# EAGLE design BOTTOM_BRD_v.1.0.4 (EAGLE 9.6.2)
NYU Shanghai Swarm Robotics 2020
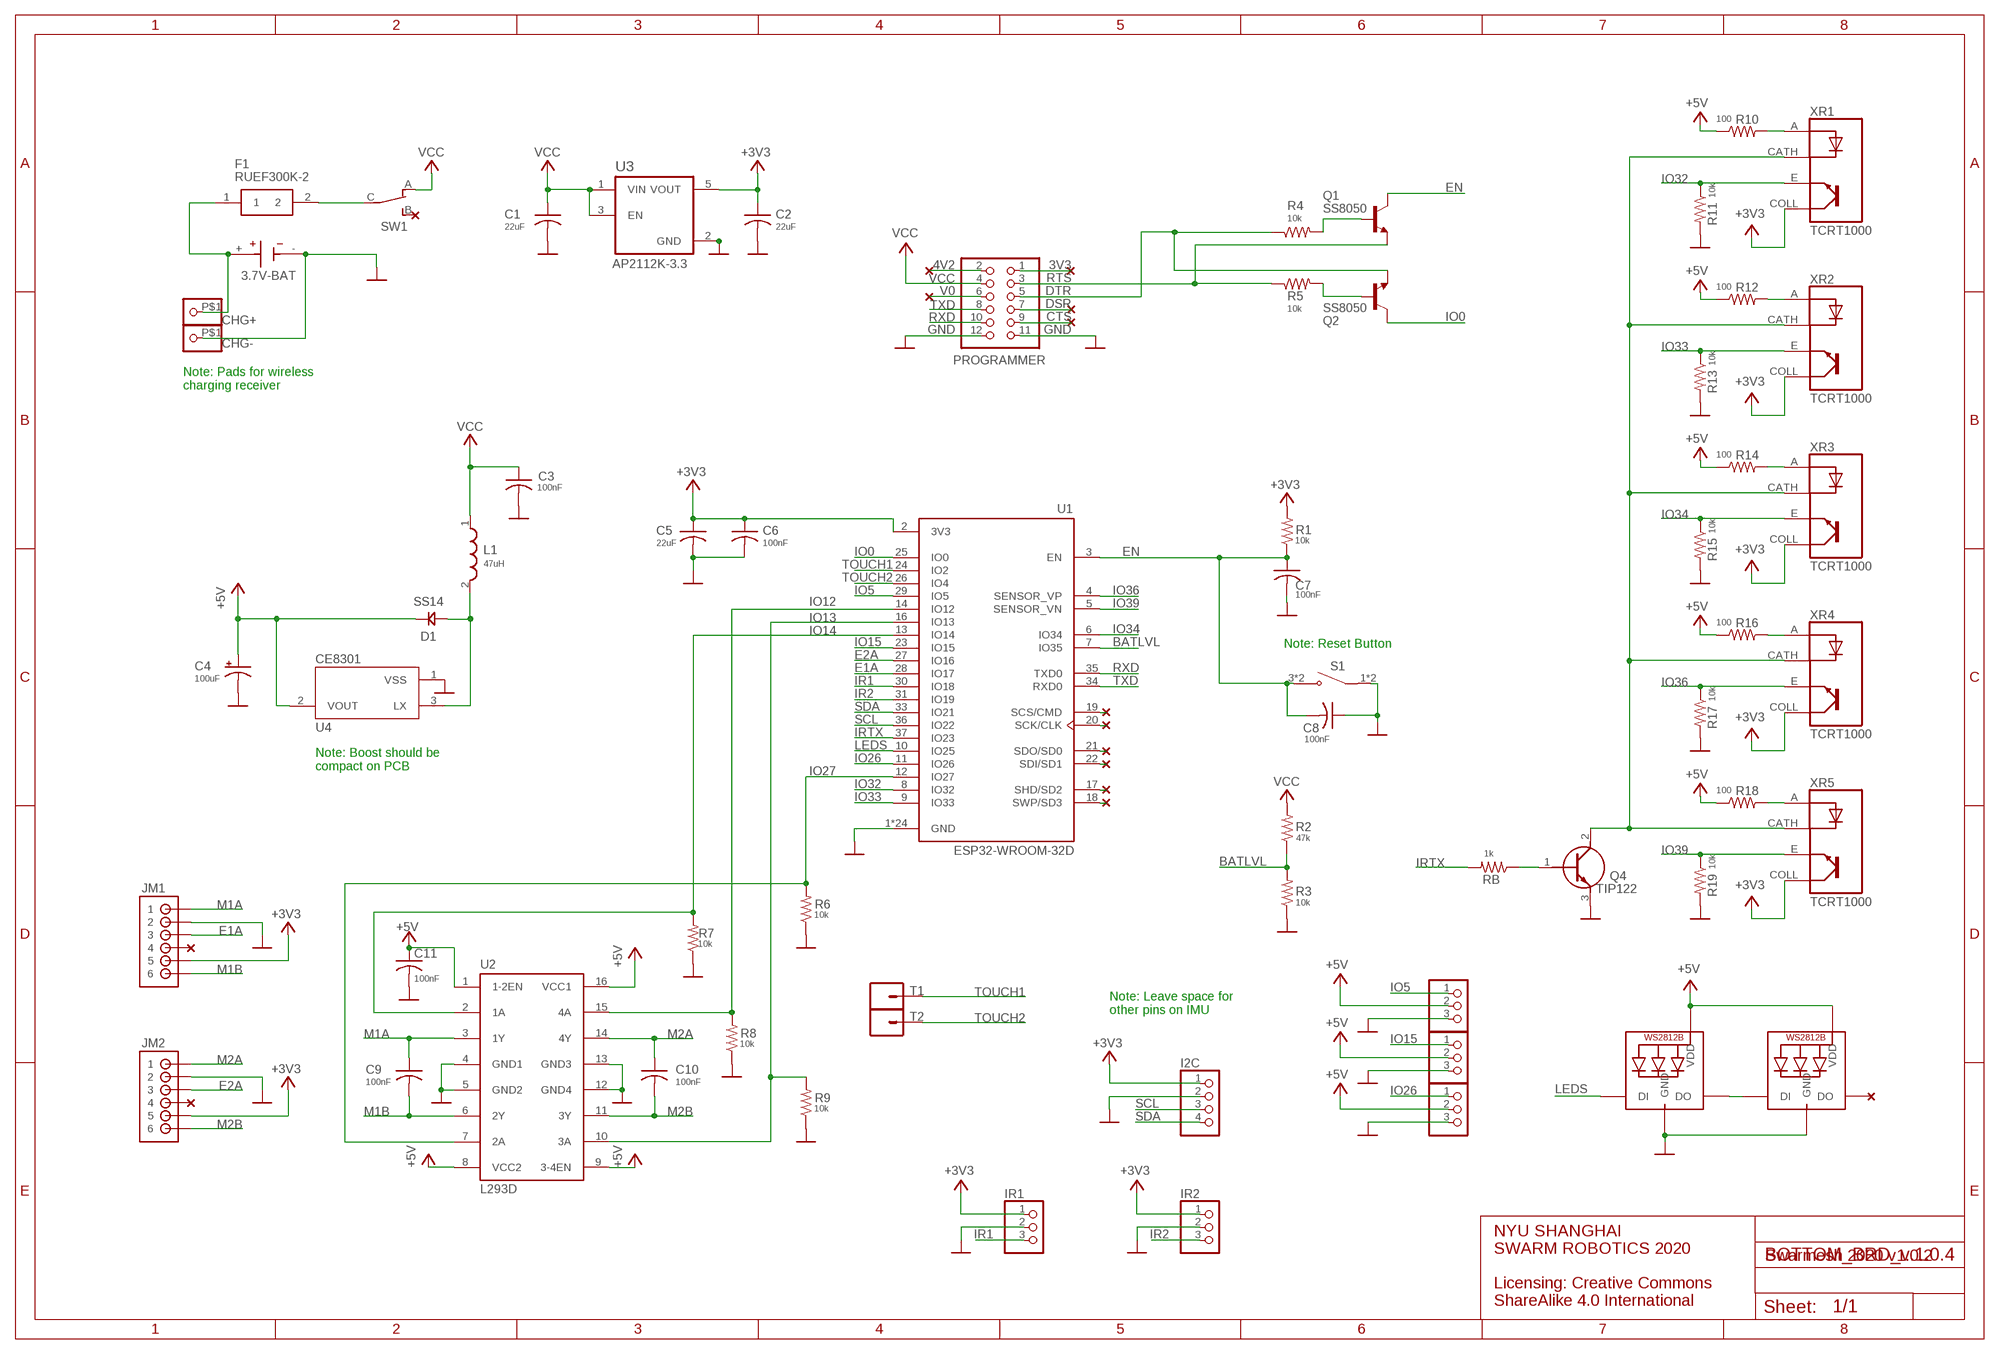
[diagram p0: schematic, sheet 1]

## Parts
BT  3.7V-BAT  6S-AA  [BAT_6S-AA]
C1  22uF  C-USC0805  [C0805]
C2  22uF  C-USC0805  [C0805]
C3  100nF  C-USC0805  [C0805]
C4  100uF  CPOL-US153CLV-0605  [153CLV-0605]
C5  22uF  C-USC0805  [C0805]
C6  100nF  C-USC0805  [C0805]
C7  100nF  C-USC0805  [C0805]
C8  100nF  C-USC0805  [C0805]
C9  100nF  C-USC0805  [C0805]
C10  100nF  C-USC0805  [C0805]
C11  100nF  C-USC0805  [C0805]
CHARGING  WS2812B5050  [WS2812B]
CHG+  PINHD-1X1-BIGPOGO  [1X1-BIGPOGO]
CHG-  PINHD-1X1-BIGPOGO  [1X1-BIGPOGO]
D1  SS14  [DO214]
F1  RUEF300K-2  [RUEF300K2]
GPIO5  PINHD-1X3  [1X03]
GPIO15  PINHD-1X3  [1X03]
GPIO26  PINHD-1X3  [1X03]
I2C  PINHD-1X4  [1X04]
IR1  PINHD-1X3  [1X03]
IR2  PINHD-1X3  [1X03]
JM1  B6B-ZR  [B6B-ZR]
JM2  B6B-ZR  [B6B-ZR]
L1  47uH  SDR0604-100KL  [INDP5858X480N]
PROGRAMMER  PINHD-2X6  [2X06]
Q1  SS8050  BC850  [SOT23]
Q2  SS8050  BC850  [SOT23]
Q4  TIP122  [TO270P460X1020X2008-3P]
R1  10k  R-US_M0805  [M0805]
R2  47k  R-US_M0805  [M0805]
R3  10k  R-US_M0805  [M0805]
R4  10k  R-US_M0805  [M0805]
R5  10k  R-US_M0805  [M0805]
R6  10k  R-US_M0805  [M0805]
R7  10k  R-US_M0805  [M0805]
R8  10k  R-US_M0805  [M0805]
R9  10k  R-US_M0805  [M0805]
R10  100  R-US_M0805  [M0805]
R11  10k  R-US_M0805  [M0805]
R12  100  R-US_M0805  [M0805]
R13  10k  R-US_M0805  [M0805]
R14  100  R-US_M0805  [M0805]
R15  10k  R-US_M0805  [M0805]
R16  100  R-US_M0805  [M0805]
R17  10k  R-US_M0805  [M0805]
R18  100  R-US_M0805  [M0805]
R19  10k  R-US_M0805  [M0805]
RB  1k  R-US_M0805  [M0805]
S1  2-1437565-9  [SW_2-1437565-9]
STATE  WS2812B5050  [WS2812B]
SW1  CS12ANW03  [CS12ANW03]
T1  CONN_01SPRING-CONN  [SPRING-CONNECTOR]
T2  CONN_01SPRING-CONN  [SPRING-CONNECTOR]
U1  ESP32-WROOM-32D  [MODULE_ESP32-WROOM-32D]
U2  L293D  [DIL16]
U3  AP2112K-3.3  AP2112K-3.3TRG1  [SOT95P285X140-5N]
U4  CE8301  MCP1702T-3302E/MB  [REG_MCP1702T-3302E/MB]
XR1  TCRT1000  [XDCR_TCRT1000]
XR2  TCRT1000  [XDCR_TCRT1000]
XR3  TCRT1000  [XDCR_TCRT1000]
XR4  TCRT1000  [XDCR_TCRT1000]
XR5  TCRT1000  [XDCR_TCRT1000]

## Nets
3V3: PROGRAMMER.1
4V2: PROGRAMMER.2
+3V3: C2.1 C5.1 C6.1 I2C.1 IR1.1 IR2.1 JM1.5 JM2.5 R1.2 U1.2(3V3) U3.5(VOUT) XR1.COLL(CO) XR2.COLL(CO) XR3.COLL(CO) XR4.COLL(CO) XR5.COLL(CO)
+5V: C4.+ C11.1 CHARGING.1-VDD(VDD) D1.CATHODE(KATHODE) GPIO5.2 GPIO15.2 GPIO26.2 R10.1 R12.1 R14.1 R16.1 R18.1 STATE.1-VDD(VDD) U2.1(1-2EN) U2.8(VCC2) U2.9(3-4EN) U2.16(VCC1) U4.2(VOUT)
BATLVL: R2.1 R3.2 U1.7(IO35)
CTS: PROGRAMMER.9
DSR: PROGRAMMER.7
DTR: PROGRAMMER.5 Q2.2(E) R4.1
E1A: JM1.3 U1.28(IO17)
E2A: JM2.3 U1.27(IO16)
EN: C7.1 C8.2 Q1.3(C) R1.1 S1.3(NO) S1.4(NO) U1.3(EN)
GND: BT.- C1.2 C2.2 C3.2 C4.- C5.2 C6.2 C7.2 C8.1 C11.2 CHARGING.3-GND(GND) CHG-.P$1 GPIO5.3 GPIO15.3 GPIO26.3 I2C.2 IR1.2 IR2.2 JM1.2 JM2.2 PROGRAMMER.11 PROGRAMMER.12 Q4.3(E) R3.1 R6.1 R7.1 R8.1 R9.1 R11.2 R13.2 R15.2 R17.2 R19.2 S1.1(COM) S1.2(COM) STATE.3-GND(GND) U1.1(GND) U1.15(GND) U1.38(GND) U1.39_1(GND) U1.39_2(GND) U1.39_3(GND) U1.39_4(GND) U1.39_5(GND) U1.39_6(GND) U1.39_7(GND) U1.39_8(GND) U1.39_9(GND) U1.39_10(GND) U1.39_11(GND) U1.39_12(GND) U1.39_13(GND) U1.39_14(GND) U1.39_15(GND) U1.39_16(GND) U1.39_17(GND) U1.39_18(GND) U1.39_19(GND) U1.39_20(GND) U1.39_21(GND) U2.4(GND1) U2.5(GND2) U2.12(GND4) U2.13(GND3) U3.2(GND) U4.1(VSS)
IO0: Q2.3(C) U1.25(IO0)
IO5: GPIO5.1 U1.29(IO5)
IO12: R8.2 U1.14(IO12) U2.15(4A)
IO13: R9.2 U1.16(IO13) U2.10(3A)
IO14: R7.2 U1.13(IO14) U2.2(1A)
IO15: GPIO15.1 U1.23(IO15)
IO26: GPIO26.1 U1.11(IO26)
IO27: R6.2 U1.12(IO27) U2.7(2A)
IO32: R11.1 U1.8(IO32) XR1.E
IO33: R13.1 U1.9(IO33) XR2.E
IO34: R15.1 U1.6(IO34) XR3.E
IO36: R17.1 U1.4(SENSOR_VP) XR4.E
IO39: R19.1 U1.5(SENSOR_VN) XR5.E
IR1: IR1.3 U1.30(IO18)
IR2: IR2.3 U1.31(IO19)
IRTX: RB.2 U1.37(IO23)
LEDS: CHARGING.4-DIN(DI) U1.10(IO25)
M1A: C9.1 JM1.1 U2.3(1Y)
M1B: C9.2 JM1.6 U2.6(2Y)
M2A: C10.1 JM2.1 U2.14(4Y)
M2B: C10.2 JM2.6 U2.11(3Y)
N$1: BT.+ CHG+.P$1 F1.1
N$2: Q4.1(B) RB.1
N$3: F1.2 SW1.C
N$4: D1.ANODE L1.2 U4.3(LX)
N$5: U1.19(SCS/CMD)
N$6: R12.2 XR2.A
N$7: R16.2 XR4.A
N$8: Q4.2(C) XR1.CATH(C) XR2.CATH(C) XR3.CATH(C) XR4.CATH(C) XR5.CATH(C)
N$9: CHARGING.2-DOUT(DO) STATE.4-DIN(DI)
N$10: R14.2 XR3.A
N$11: R18.2 XR5.A
N$12: Q1.1(B) R4.2
N$13: R10.2 XR1.A
N$15: Q2.1(B) R5.2
N$16: U1.20(SCK/CLK)
N$18: U1.21(SDO/SD0)
N$23: U1.22(SDI/SD1)
N$24: U1.17(SHD/SD2)
N$25: U1.18(SWP/SD3)
RTS: PROGRAMMER.3 Q1.2(E) R5.1
RXD: PROGRAMMER.10 U1.35(TXD0)
SCL: I2C.3 U1.36(IO22)
SDA: I2C.4 U1.33(IO21)
TOUCH1: T1.P$2 U1.24(IO2)
TOUCH2: T2.P$2 U1.26(IO4)
TXD: PROGRAMMER.8 U1.34(RXD0)
V0: PROGRAMMER.6
VCC: C1.1 C3.1 L1.1 PROGRAMMER.4 R2.2 SW1.A U3.1(VIN) U3.3(EN)
Unconnected: JM1.4 JM2.4 STATE.2-DOUT(DO) SW1.B

## Notes on the sheet
- Note: Pads for wireless 
  charging receiver
- Note: Reset Button
- Note: Boost should be
  compact on PCB
- Note: Leave space for 
  other pins on IMU
- Swarmesh 2020 v1.0.2
- NYU SHANGHAI
  SWARM ROBOTICS 2020
  
  Licensing: Creative Commons
  ShareAlike 4.0 International

## Library data of the parts
BT = 6S-AA:6S-AA; AVAILABILITY: Unavailable; DESCRIPTION: BATTERY HOLDER AA PC PIN; DIGIKEY-PURCHASE-URL: https://snapeda.com/shop?store=DigiKey&id=4389101; MF: MPD; MP: 6S-AA; PACKAGE: None; PRICE: None
C1-C3 C5-C11 = rcl:C-US: CAPACITOR, American symbol; SPICEPREFIX: C
C4 = rcl:CPOL-US: POLARIZED CAPACITOR, American symbol; SPICEPREFIX: C
CHARGING STATE = adafruit:WS2812B
CHG+ CHG- = adafruit:PINHD-1X1: Pin header 1x1 for 0.1" spacing With round pins
D1 = SS14:SS14; AVAILABILITY: Unavailable; DESCRIPTION: Diode Schottky 40V 1A Surface Mount SMA (DO-214AC); DIGIKEY-PURCHASE-URL: https://snapeda.com/shop?store=DigiKey&id=229686; MF: ON Semiconductor; MP: SS14; PACKAGE: DO-214AC-214 ON Semiconductor; PRICE: None
F1 = RUEF300K-2:RUEF300K-2: TE CONNECTIVITY / RAYCHEM - RUEF300K-2 - RESETTABLE FUSE, PTC, 30V, 3A, RADIAL Source: Datasheet; DESCRIPTION: TE CONNECTIVITY / RAYCHEM - RUEF300K-2 - RESETTABLE FUSE, PTC, 30V, 3A, RADIAL; HEIGHT: 16.5mm; MANUFACTURER_NAME: TE CONNECTIVITY / RAYCHEM; MANUFACTURER_PART_NUMBER: RUEF300K-2
GPIO5 GPIO15 GPIO26 IR1 IR2 = adafruit:PINHD-1X3: PIN HEADER
I2C = pinhead:PINHD-1X4: PIN HEADER
JM1 JM2 = B6B-ZR:B6B-ZR: JST-ZH Connector 6 pol, 1.5mm pitch Package: B6B-ZR Source: http://www.jst-mfg.com/product/pdf/eng/eZH.pdf; AVAILABILITY: Unavailable; DESCRIPTION: Connector Header Surface Mount 6 position 0.059 _1.50mm_; MF: JST; MP: B6B-ZR; PACKAGE: None; PRICE: None
L1 = SDR0604-100KL:SDR0604-100KL: Inductor Power Wirewound 120uH 10% 1KHz 22Q-Factor Ferrite 480mA 930mOhm DCR T/R; AVAILABILITY: Unavailable; DESCRIPTION: 10µH Unshielded Wirewound Inductor Nonstandard; MF: Bourns; MP: SDR0604-100KL; PACKAGE: Nonstandard Bourns; PRICE: None
PROGRAMMER = pinhead:PINHD-2X6: PIN HEADER
Q1 Q2 = transistor:BC850: NPN TRANSISTOR
Q4 = TIP122:TIP122: TIP122, Darlington Transistor, NPN 8 A 100 V HFE:1000, 3-Pin, TO-220 Source: Datasheet; DESCRIPTION: TIP122, Darlington Transistor, NPN 8 A 100 V HFE:1000, 3-Pin, TO-220; HEIGHT: 4.6mm; MANUFACTURER_NAME: STMicroelectronics; MANUFACTURER_PART_NUMBER: TIP122; MOUSER_PART_NUMBER: 511-TIP122; MOUSER_PRICE-STOCK: https://www.mouser.com/Search/Refine.aspx?Keyword=511-TIP122
R1-R19 RB = rcl:R-US_: RESISTOR, American symbol; SPICEPREFIX: R
S1 = pushswitch:2-1437565-9; AVAILABILITY: Unavailable; COMMENT: 2-1437565-9; DESCRIPTION: Tactile Switch SPST-NO Top Actuated Surface Mount; MF: TE Connectivity; MP: 2-1437565-9; PACKAGE: SMD-6 Omron Electronics; PRICE: None
SW1 = SWITCH_C:CS12ANW03; AVAILABILITY: Unavailable; DESCRIPTION: Slide Switch SPDT Through Hole; DIGIKEY-PURCHASE-URL: https://snapeda.com/shop?store=DigiKey&id=478299; MF: NKK Switches; MP: CS12ANW03; PACKAGE: None; PRICE: None
T1 = Touch_Pad2:CONN_01: Single connection point. Often used as Generic Header-pin footprint for 0.1 inch spaced/style header connections On any of the 0.1 inch spaced packages, you can populate with these: Break Away Headers - Straight (PRT-00116) Break Away Male Headers - Right Angle (PRT-00553) Female Headers (PRT-00115) Break Away Headers - Machine Pin (PRT-00117) Break Away Female Headers - Swiss Machine Pin (PRT-00743) This device is also useful as a general connection point to wire up your design to another part of your project. Our various solder wires solder well into these plated through hole pads. Hook-Up Wire - Assortment (Stranded, 22 AWG) (PRT-11375) Hook-Up Wire - Assortment (Solid Core, 22 AWG) (PRT-11367) View the entire wire category on our website here Special notes: SMTSO-256-ET is a "flush mount" nut for a 4-40 screw. We mostly use this on specialty testbeds; it is a nice way to connect hardware to your PCB at an adjustable hieght. Also note, the SNAP packages are for using a snappable style connector. We sell a baggie of snaps and they are also used on two LilyPad designs: Snap Assortment - 30 pack (male and female) (DEV-11347) LilyPad Arduino SimpleSnap (DEV-10941) LilyPad SimpleSnap Protoboard (DEV-10940); SF_ID: PRT-11822
T2 = Touch_Pad:CONN_01: Single connection point. Often used as Generic Header-pin footprint for 0.1 inch spaced/style header connections On any of the 0.1 inch spaced packages, you can populate with these: Break Away Headers - Straight (PRT-00116) Break Away Male Headers - Right Angle (PRT-00553) Female Headers (PRT-00115) Break Away Headers - Machine Pin (PRT-00117) Break Away Female Headers - Swiss Machine Pin (PRT-00743) This device is also useful as a general connection point to wire up your design to another part of your project. Our various solder wires solder well into these plated through hole pads. Hook-Up Wire - Assortment (Stranded, 22 AWG) (PRT-11375) Hook-Up Wire - Assortment (Solid Core, 22 AWG) (PRT-11367) View the entire wire category on our website here Special notes: SMTSO-256-ET is a "flush mount" nut for a 4-40 screw. We mostly use this on specialty testbeds; it is a nice way to connect hardware to your PCB at an adjustable hieght. Also note, the SNAP packages are for using a snappable style connector. We sell a baggie of snaps and they are also used on two LilyPad designs: Snap Assortment - 30 pack (male and female) (DEV-11347) LilyPad Arduino SimpleSnap (DEV-10941) LilyPad SimpleSnap Protoboard (DEV-10940); SF_ID: PRT-11822
U1 = ESP32-WROOM-32D:ESP32-WROOM-32D: Bluetooth, WiFi 802.11b/g/n, Bluetooth v4.2 + EDR, Class 1, 2 and 3 Transceiver Module 2.4GHz ~ 2.5GHz Integrated, Trace Surface Mount; AVAILABILITY: Unavailable; DESCRIPTION: Bluetooth, WiFi 802.11b/g/n, Bluetooth v4.2 +EDR, Class 1, 2 and 3 Transceiver Module 2.4GHz ~ 2.5GHz Integrated, Trace Surface Mount; MF: Espressif Systems; MP: ESP32-WROOM-32D; PACKAGE: Module Espressif Systems; PRICE: None
U2 = st-microelectronics:L293D: PUSH-PULL 4 CHANNEL DRIVER; MPN: L293D; OC_FARNELL: 9589619; OC_NEWARK: 56P8249
U3 = AP2112K-3.3TRG1:AP2112K-3.3TRG1: AP2112 Series 0.6 A 3.3 V Fixed Output SMT LDO Linear Regulator - SOT23-5; AVAILABILITY: Unavailable; DESCRIPTION: Linear Voltage Regulator IC 1 Output 600mA SOT-25; MF: Diodes Inc.; MP: AP2112K-3.3TRG1; PACKAGE: SOT-753 Diodes Inc.; PRICE: None
U4 = MCP1702T-3302E_MB:MCP1702T-3302E/MB: MCP1702 Series 250 mA 3.3 V Fixed Output Surface Mount LDO Regulator - SOT-89; AVAILABILITY: Unavailable; DESCRIPTION: Linear Voltage Regulator IC 1 Output 250mA SOT-89-3; MF: Microchip; MP: MCP1702T-3302E/MB; PACKAGE: SOT-89 Microchip; PRICE: None
XR1-XR5 = ST188:TCRT1000: Optical Sensor The TCRT1000 and TCRT1010 are reflective sensors which include an infrared emitter and phototransistor in a leaded package which blocks visible light; AVAILABILITY: Unavailable; DESCRIPTION: Reflective Optical Sensor 0.157 (4mm) PCB Mount; MF: Vishay; MP: TCRT1000; PACKAGE: PCB Mount Vishay; PRICE: None

## Board
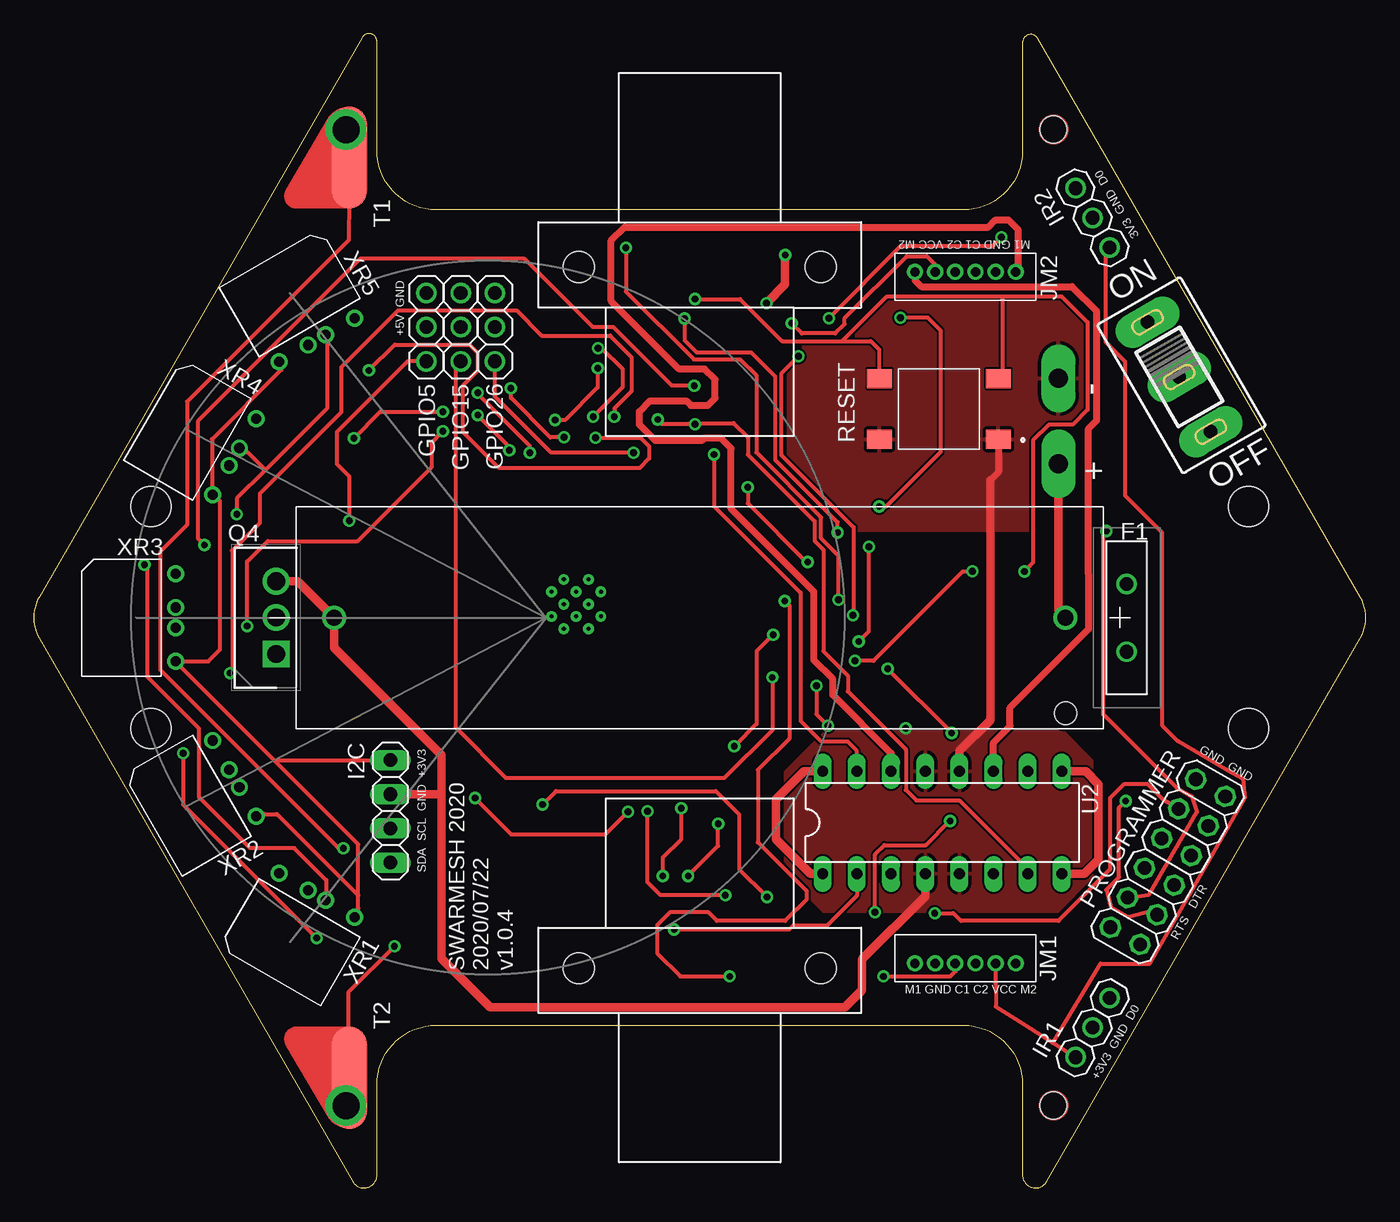
[diagram p1: board, top side]
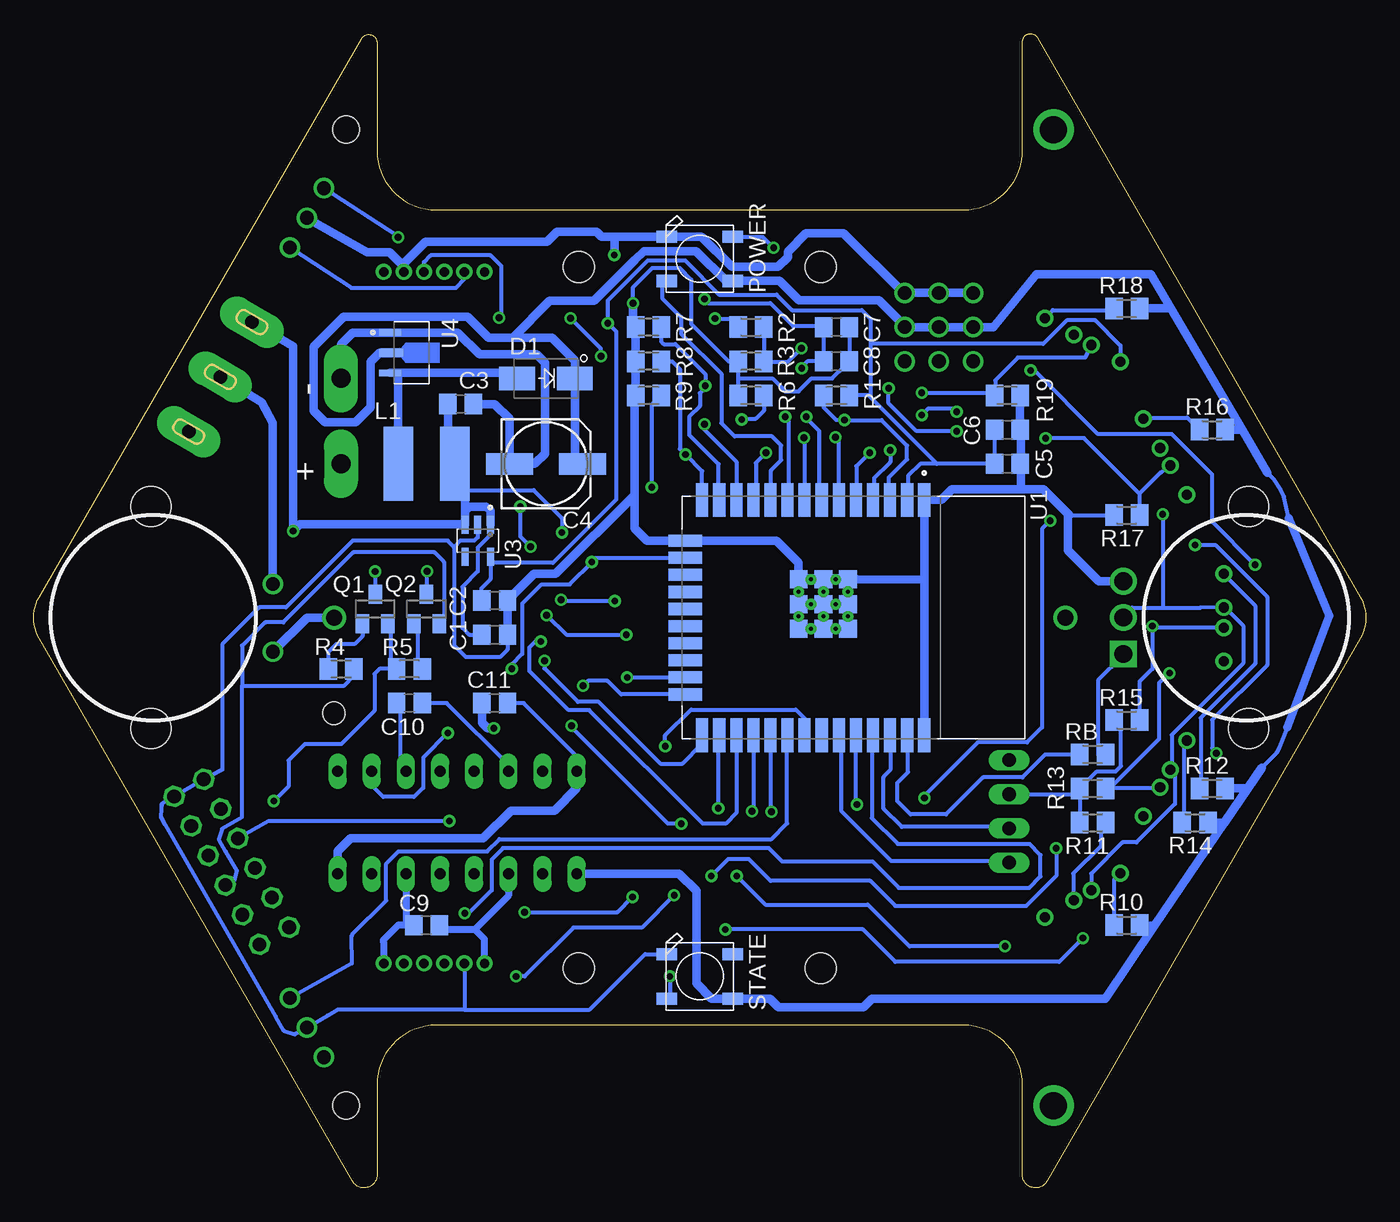
[diagram p2: board, bottom side, seen from below]

Size 99.06 x 85.8 mm. Coordinates in mm from the lower left corner, seen from the top.
Outline: 75.33,0.48 98.65,40.87 arc60 98.65,43.91 74.68,85.43 arc150 73.53,85.12 73.53,77.1 arc-90 69.12,72.69 29.94,72.69 arc-90 25.53,77.1 25.53,85.2 arc150 24.42,85.5 0.41,43.91 arc60 0.41,40.87 23.73,0.48 arc150 25.53,0.97 25.53,7.68 arc-90 29.94,12.09 69.12,12.09 arc-90 73.53,7.68 73.53,0.97 arc150 75.33,0.48
Copper layers (1*16): Top 0.035mm / dielectric 0.15mm / Bottom 0.035mm
Design rules "default *": minimum track width 12mil, minimum drill 0.5mm, track to track 6mil, track to pad 6mil, pad to pad 6mil, via to via 20mil, smd to smd 6mil, copper to edge 0.5mm, drill to drill 25mil, minimum pad ring 10mil, minimum via ring 8mil, stop-mask expansion 4mil, vias tented up to drill 0mil, thermal gap 10mil
Holes 2 mm at 75.83,78.66 75.83,6.12
Holes 3 mm at 8.73,50.64 8.73,34.14 90.33,50.64 90.33,34.14
Holes 2.3 mm at 58.53,16.33 40.53,16.33 40.53,68.45 58.53,68.45
tKeepout: area 74.2,77 to 77.5,80.3; area 74.2,4.5 to 77.5,7.7
tRestrict: area 30.8,33.4 to 49.8,51.3

### Footprints (pad centres in the part's own frame; a part is rotated, then mirrored left to right if it is on the bottom)
BAT_6S-AA = drill 1.19: + -27.2,0; - 27.2,0 | hole 1.67: -27.2,7.1
C0805 = smd 1.3 x 1.5: 1 -0.95,0; 2 0.95,0
153CLV-0605 = smd 3.5 x 1.6: + 2.7,0; - -2.7,0
WS2812B = smd 1.5 x 0.9: 1-VDD 2.45,-1.65; 2-DOUT 2.45,1.65; 3-GND -2.45,1.65; 4-DIN -2.45,-1.65
1X1-BIGPOGO = drill 1.4 pad 2.54 long: P$1 0,0
DO214 = smd 2.65 x 1.75: ANODE -2.15,0; CATHODE 2.15,0
RUEF300K2 = drill 1.01 pad 1.515: 1 0,0; 2 5.05,0
1X03 = drill 1.016: 1 -2.54,0; 2 0,0; 3 2.54,0
1X04 = drill 1.016 long: 1 -3.81,0; 2 -1.27,0; 3 1.27,0; 4 3.81,0
B6B-ZR = drill 0.7: 1 9,-1.3; 2 7.5,-1.3; 3 6,-1.3; 4 4.5,-1.3; 5 3,-1.3; 6 1.5,-1.3
INDP5858X480N = smd 2.2 x 5.5: 1 -2.1,0; 2 2.1,0
2X06 = drill 1.016 octagon: 1 -6.35,-1.27; 2 -6.35,1.27; 3 -3.81,-1.27; 4 -3.81,1.27; 5 -1.27,-1.27; 6 -1.27,1.27; 7 1.27,-1.27; 8 1.27,1.27; 9 3.81,-1.27; 10 3.81,1.27; 11 6.35,-1.27; 12 6.35,1.27
SOT23 = smd 1 x 1.4: 1 -0.95,-1.1; 2 0.95,-1.1; 3 0,1.1
TO270P460X1020X2008-3P = drill 1.32 pad 1.98 square: 1 0,0 | drill 1.32 pad 1.98: 2 2.7,0; 3 5.4,0
M0805 = smd 1.3 x 1.6: 1 -0.95,0; 2 0.95,0
SW_2-1437565-9 = smd 1.846 x 1.4: 1 -4.423,2.25; 2 4.423,2.25; 3 -4.423,-2.25; 4 4.423,-2.25
CS12ANW03 = drill 1 pad 2.54 long: A -4.674,0; B 4.724,0; C 0.025,0
SPRING-CONNECTOR = smd 2.6 x 7.6: P$2 0,0
MODULE_ESP32-WROOM-32D = smd 2.5 x 0.9: 1 -8.75,5.26; 2 -8.75,3.99; 3 -8.75,2.72; 4 -8.75,1.45; 5 -8.75,0.18; 6 -8.75,-1.09; 7 -8.75,-2.36; 8 -8.75,-3.63; 9 -8.75,-4.9; 10 -8.75,-6.17; 11 -8.75,-7.44; 12 -8.75,-8.71; 13 -8.75,-9.98; 14 -8.75,-11.25; 25 8.75,-11.25; 26 8.75,-9.98; 27 8.75,-8.71; 28 8.75,-7.44; 29 8.75,-6.17; 30 8.75,-4.9; 31 8.75,-3.63; 32 8.75,-2.36; 33 8.75,-1.09; 34 8.75,0.18; 35 8.75,1.45; 36 8.75,2.72; 37 8.75,3.99; 38 8.75,5.26 | smd 0.9 x 2.5: 15 -5.715,-12.5; 16 -4.445,-12.5; 17 -3.175,-12.5; 18 -1.905,-12.5; 19 -0.635,-12.5; 20 0.635,-12.5; 21 1.905,-12.5; 22 3.175,-12.5; 23 4.445,-12.5; 24 5.715,-12.5 | smd 1.33 x 1.33: 39_1 -2.835,-0.405; 39_2 -1,-0.405; 39_3 0.835,-0.405; 39_4 -2.835,-2.24; 39_5 -1,-2.24; 39_6 0.835,-2.24; 39_7 -2.835,-4.075; 39_8 -1,-4.075; 39_9 0.835,-4.075 | drill 0.3 pad 0.4: 39_10 -1.917,-0.405; 39_11 -0.083,-0.405; 39_12 -2.835,-1.323; 39_13 -1,-1.323; 39_14 0.835,-1.323; 39_15 -1.917,-2.24; 39_16 -0.083,-2.24; 39_17 -2.835,-3.158; 39_18 -1,-3.158; 39_19 0.835,-3.158; 39_20 -1.917,-4.075; 39_21 -0.083,-4.075
DIL16 = drill 0.813 long: 1 -8.89,-3.81; 2 -6.35,-3.81; 3 -3.81,-3.81; 4 -1.27,-3.81; 5 1.27,-3.81; 6 3.81,-3.81; 7 6.35,-3.81; 8 8.89,-3.81; 9 8.89,3.81; 10 6.35,3.81; 11 3.81,3.81; 12 1.27,3.81; 13 -1.27,3.81; 14 -3.81,3.81; 15 -6.35,3.81; 16 -8.89,3.81
SOT95P285X140-5N = smd 1.35 x 0.6: 1 -1.185,0.95; 2 -1.185,0; 3 -1.185,-0.95; 4 1.185,-0.95; 5 1.185,0.95
REG_MCP1702T-3302E/MB = smd 1.654 x 0.48: 1 -1.425,1.5; 3 -1.425,-1.5 | smd 1.779 x 0.56: 2 -1.365,0
XDCR_TCRT1000 = drill 0.75 pad 1.1: A -3.25,4.035; CATH -0.75,4.035; COLL 3.25,4.035; E 0.75,4.035

### Placement (x,y rotation side)
BT  49.53,42.39 180 top
C1  64.77,41.12 0 bottom
C2  64.77,43.66 0 bottom
C3  67.31,58.27 0 bottom
C4  60.96,53.82 0 bottom
C5  26.67,53.82 0 bottom
C6  26.67,56.36 0 bottom
C7  39.37,63.98 0 bottom
C8  39.37,61.44 180 bottom
C9  69.85,19.53 180 bottom
C10  71.12,36.04 180 bottom
C11  64.77,36.04 180 bottom
CHARGING  49.53,69.06 0 bottom
CHG+  76.2,53.82 270 bottom
CHG-  76.2,60.17 90 top
D1  60.96,60.17 0 bottom
F1  81.28,39.85 90 top
GPIO5  29.21,63.98 90 top
GPIO15  31.75,63.98 90 top
GPIO26  34.29,63.98 90 top
I2C  26.53,27.99 270 top
IR1  78.74,11.91 60 top
IR2  78.74,72.11 120 top
JM1  74.53,15.39 180 top
JM2  64.03,69.39 0 top
L1  69.85,53.82 180 bottom
PROGRAMMER  84.34,24.24 60 top
Q1  73.66,43.03 0 bottom
Q2  69.85,43.03 0 bottom
Q4  18.03,39.69 90 top
R1  39.37,58.9 0 bottom
R2  45.72,63.98 180 bottom
R3  45.72,61.44 0 bottom
R4  76.2,38.58 180 bottom
R5  71.12,38.58 0 bottom
R6  45.72,58.9 0 bottom
R7  53.34,63.98 0 bottom
R8  53.34,61.44 0 bottom
R9  53.34,58.9 0 bottom
R10  17.78,19.53 180 bottom
R11  20.32,27.15 180 bottom
R12  12.7,27.15 180 bottom
R13  20.32,29.69 180 bottom
R14  11.43,29.69 180 bottom
R15  17.78,34.77 180 bottom
R16  11.43,56.36 180 bottom
R17  17.78,50.01 180 bottom
R18  17.78,65.38 180 bottom
R19  26.67,58.9 0 bottom
RB  20.32,32.23 180 bottom
S1  67.31,57.9 180 top
STATE  49.53,15.72 0 bottom
SW1  85.16,60.3 300 top
T1  23.48,76.59 0 top
T2  23.48,8.19 0 top
U1  38.1,42.39 270 bottom
U2  67.56,27.15 0 top
U3  66.04,48.11 270 bottom
U4  71.12,62.08 0 bottom
XR1  19.05,18.26 330 top
XR2  11.43,28.42 300 top
XR3  6.53,42.39 270 top
XR4  11.43,56.36 240 top
XR5  19.05,66.52 210 top

### Tracks (layer width: path | path; a pad name or v marks a point on that pad's centre or on a via)
+3V3  (via drill 0.5)
  Top 0.305: 24.13,21.75 24.13,20.8 XR1.COLL | 24.13,21.75 18.1,27.79 17.14,27.79 XR2.COLL | 24.13,21.75 24.14,21.74 24.14,25.54 17.88,31.8 | XR5.COLL 18.41,60.81 13.27,55.66 13.27,51.56 XR4.COLL 13.87,51.05 13.87,40.03 12.98,39.14 XR3.COLL 10.54,39.14 17.88,31.8 | IR2.1 79.97,69.91 79.69,69.63 79.69,62.9 81.15,61.44 81.15,51.47 83.91,48.72 83.91,34.39 85.09,33.21 85.1,33.21 86.83,32.19 88.84,31.02 89.89,30.41 90.04,28.97 82.98,16.67 82.55,16.67 79.33,16.67 75.78,10.78 | v56.36,64.27 57.12,63.51 59.6,63.51 60.3,64.21 60.3,64.64 64.92,69.26 66.4,69.26 67.03,68.64 JM2.5 | 75.78,10.78 73.34,12.33 71.54,13.48 JM1.5 | 75.78,10.78 IR1.1 | 17.88,31.8 I2C.1
  Bottom 0.305: U1.2 34.04,51.22 34.04,52.92 33.14,53.82 31.9,53.82 | 36.83,62.74 36.83,64.59 37.47,65.24 42.66,65.24 43.81,66.39 48.08,66.39 50.62,68.94 53.39,68.94 56.36,65.96 v56.36,64.27 55.75,63.66 55.75,51.15 60.44,46.46 65.09,46.46 U3.5 65.09,45.25 65.79,44.55 65.79,43.73 C2.1 | 36.83,62.74 36.83,58.9 36.98,58.9 | 31.9,53.82 C5.1 C6.1 | 36.98,58.9 R1.2 | 36.83,62.74 23.98,62.74 22.24,64.48 20.12,64.48 18.25,62.61 XR5.COLL | JM2.5 67.03,67.58 67.67,66.9 75.43,66.9 IR2.1 | 31.9,53.82 36.98,58.9
+5V
  Top 0.635: U2.16 57.28,30.96 55.19,28.88 55.19,25.91 57.76,23.34 U2.1 | U2.9 78.24,30.96 79.18,30.02 79.18,24.38 78.13,23.34 U2.8
  Bottom 0.305: 5.83,34.23 6.43,32.74 6.63,32.36 7.75,31.24 | 5.71,49.76 6.1,51.41 6.35,51.92 6.86,52.68 7.32,53.17 | U2.16 58.67,32.09 62.62,36.04 C11.1
  Bottom 0.635: U2.1 51.05,23.34 49.78,22.07 49.78,15.21 48.64,14.07 48.28,14.07 STATE.1-VDD 44.32,14.07 43.69,13.44 37.36,13.44 36.72,14.07 19.39,14.07 15.73,19.48 | 7.75,31.24 8.79,29.71 | 8.79,29.71 10.53,27.14 | 10.53,27.14 15.73,19.48 | C4.+ 58.26,53.57 58.81,54.12 D1.CATHODE 58.81,61.48 60.53,63.19 63.42,63.19 | 63.42,63.19 65.23,63.19 66.8,64.77 76,64.77 78.23,62.53 78.23,57.76 77.39,56.92 75.11,56.92 74.02,58.01 74.02,61.39 73.33,62.08 U4.2 | 5.83,34.23 2.71,42.53 5.71,49.76 | 7.32,53.17 9.18,56.34 | 9.18,56.34 14.49,65.39 | 14.49,65.39 15.97,67.92 24.49,67.92 27.71,63.98 GPIO5.2 GPIO15.2 GPIO26.2 34.29,64.06 36.19,65.96 42.15,65.96 43.6,67.41 CHARGING.1-VDD 47.59,67.41 49.81,69.64 53.68,69.64 54.35,68.98 57.39,65.93 60.69,65.93 63.42,63.19 | R14.1 8.79,29.71 | R12.1 10.53,27.14 | R10.1 15.73,19.48 | R16.1 9.18,56.34 | R18.1 14.49,65.39 | U2.16 58.67,29.69 60.32,28.04 63.58,28.04 65.63,25.98 75.49,25.98 76.45,25.02 U2.8
BATLVL  (via drill 0.5)
  Top 0.305: v41.96,62.41 42.24,62.41 43.81,60.83 43.81,59.54 v41.6,57.33
  Bottom 0.305: 44.77,61.76 R2.1 | 44.77,61.76 R3.2 44.77,61.76 | v41.96,62.41 42.96,61.41 44.42,61.41 44.77,61.76 | v41.6,57.33 41.6,57.2 40.64,56.23 40.64,51.28 U1.7
DTR
  Bottom 0.305: PROGRAMMER.5 84.16,22.85 83.95,23.6 84.77,24.99 85.29,25.93 85.04,26.69 83.57,27.56 83.57,37.29 | Q2.2 68.55,42.28 68.55,46.54 69.25,47.24 75.29,47.24 80.49,42.04 81.83,42.04 83.57,40.31 83.57,37.29 | R4.1 75.25,38.07 76.03,37.29 83.57,37.29
E1A  (via drill 0.5)
  Top 0.305: JM1.3 68.54,16.68 68.54,16.1 68.16,15.72 v63.18,15.72 | v45.64,27.99 45.64,22.73 46.62,21.75 v51.43,21.75
  Bottom 0.305: v63.18,15.72 62.55,15.72 58.92,19.35 53.84,19.35 v51.43,21.75 | U1.28 45.55,33.63 45.55,28.08 v45.64,27.99
E2A  (via drill 0.5)
  Top 0.305: v64.45,64.68 66.48,64.68 67.45,63.72 67.45,54.72 63.37,50.65 v62.86,50.65 | v62.1,47.65 62.1,41.36 v61.35,40.61
  Bottom 0.305: JM2.3 70.03,68.82 69.53,69.32 65.09,69.32 64.3,68.53 64.3,64.83 v64.45,64.68 | v62.86,50.65 62.86,48.41 v62.1,47.65 | v61.35,40.61 61.76,40.61 62.22,40.16 62.22,38.45 59.28,35.52 57.75,35.52 49.3,27.08 47.6,27.08 46.8,27.88 46.8,33.63 U1.27
EN  (via drill 0.5)
  Top 0.305: 60.12,62.94 55.65,62.94 52.53,66.06 v49.17,66.06 | 60.12,62.94 62.25,62.94 62.86,62.33 62.86,61.26 S1.4 | v41.94,60.92 41.94,59.51 39.51,57.07 v38.77,57.07 | 72.11,66.27 63.45,66.27 60.12,62.94 | S1.3 72.07,60.49 72.07,66.23 72.11,66.27 | v73.66,45.82 74.31,46.47 74.31,55.56 75.5,56.74 77.27,56.74 78.36,57.83 78.36,64.34 76.43,66.27 72.11,66.27
  Bottom 0.305: v73.66,45.82 Q1.3 | U1.3 35.49,51.25 35.49,52.78 34.12,54.15 34.12,55.18 36.02,57.07 v38.77,57.07 39.38,57.07 40.3,58 40.3,58.9 R1.1 | v49.17,66.06 48.87,65.76 44.28,65.76 42.57,64.04 40.38,64.04 C7.1 C8.2 41.52,61.44 41.94,61.02 v41.94,60.92
GND  (via drill 0.5)
  Top 0.508: S1.1 71.73,53.2 71.13,52.59
  Top 0.635: Q4.3 19.63,45.09 BT.- 22.33,40.15 30.33,32.15 30.33,29.19 | U2.12 68.83,32.48 71.13,34.77 71.13,52.59 | U2.4 66.29,21.69 61.59,16.99 61.59,14.69 60.32,13.42 33.95,13.42 30.33,17.05 30.33,29.19 | v54.48,65.76 55.88,67.16 v55.88,69.34 | I2C.2 30.26,29.26 30.33,29.19
  Bottom 0.305: PROGRAMMER.12 86.61,30.26 | 86.61,30.26 88.45,29.19 | 88.45,29.19 PROGRAMMER.11 | 67.06,13.26 57.71,13.26 53.59,17.37 STATE.3-GND | JM1.2 67.03,13.28 67.06,13.26 | 67.06,13.26 76.45,13.26 77.22,12.8 IR1.2 79.63,11.41 80.46,11.69 81.05,12.73 | 81.05,12.73 89.26,26.98 89.58,27.53 89.54,28.22 89.53,28.42 89.53,28.55 88.45,29.19 | 81.05,12.73 | U3.2 66.04,48.36 66.29,48.11 67.33,48.11 67.8,47.64 67.82,47.65 | U1.39_17 40.96,45.25 40.64,45.25 U1.39_4 40.32,44.93 40.32,44.61 U1.39_15 40.32,44.3 40.32,43.66 U1.39_5 40.64,43.66 40.96,43.66 U1.39_18 41.27,43.34 41.91,43.34 U1.39_8 | U1.39_9 42.23,41.76 42.23,42.39 U1.39_21 42.23,42.71 42.23,43.34 U1.39_8 | U1.39_8 42.23,43.66 42.23,44.3 U1.39_20 42.23,44.61 42.23,44.93 U1.39_7 41.95,45.52 38.13,45.52 37.84,45.23 | C7.2 C8.1 38.73,61.44 38.73,61.12 39.69,60.17 41.21,60.17 42.18,59.2 43.16,59.2 44.13,60.17 46.67,60.17 | R3.1 46.67,60.17 | 46.67,60.17 R6.1 | R13.2 20,30.96 18.61,30.96 18.21,31.36 18.21,34.77 R15.2 | R13.2 21.27,29.26 | 21.27,29.26 21.27,29.06 | 21.27,29.06 R11.2 | R13.2 21.27,29.06 | 38.73,41.76 38.73,42.39 U1.39_11 38.73,42.71 38.73,43.34 | 38.73,41.76 39.37,41.76 U1.39_14 39.69,41.76 40.32,41.76 | 38.73,41.76 U1.39_3 | U1.39_19 40.96,41.76 40.64,41.76 U1.39_6 40.32,41.76 | 40.32,41.76 40.32,42.39 U1.39_16 | 38.73,43.34 39.37,43.34 U1.39_13 | C5.2 25.65,53.82 | 22.15,50.01 22.06,50.01 R17.2 | U1.39_12 39.37,45.25 38.73,45.25 U1.39_1 38.73,44.93 38.73,44.61 U1.39_10 38.73,44.3 38.73,43.66 U1.39_2 38.73,43.34 | C6.2 25.65,56.36 | 21.27,29.26 I2C.2 | R3.1 47.38,61.44 50.16,64.23 50.16,67.51 51.03,68.38 53.06,68.38 54.48,66.95 v54.48,65.76
  Bottom 0.305: R3.1 | C1.2 63.82,40.01 64.39,39.45 66.91,39.45 67.79,40.32 67.79,47.61 67.82,47.61 67.82,47.65 | 67.82,47.65 68.27,48.11 75.34,48.11 80.29,43.15 82.28,43.15 85.03,40.4 85.03,31.09 86.61,30.26
  Bottom 0.635: 25.65,51.92 23.96,51.92 22.06,50.01 | 22.15,50.01 22.15,47.4 19.84,45.09 Q4.3 | 55.88,70.71 CHARGING.3-GND 49.4,70.71 47.14,68.45 43.7,68.45 42.99,69.16 42.99,69.59 41.61,70.97 38.84,70.97 34.39,66.52 GPIO26.3 GPIO15.3 GPIO5.3 | 54.39,51.49 54.39,58.8 R9.1 54.29,61.12 54.61,61.44 R8.1 R7.1 54.48,64.17 v54.48,65.76 | 54.39,51.49 54.39,49.05 53.45,48.11 U1.15 43.81,48.11 42.17,46.47 U1.39_7 | 37.84,45.23 U1.39_1 32.84,45.23 | 25.65,56.36 25.65,53.82 25.65,51.92 | CHG-.P$1 76.2,62.71 75.33,63.58 U4.1 67.53,63.58 65.9,61.95 61.65,61.95 61.04,61.34 61.04,54.58 61.8,53.82 C4.- 63.66,57.16 64.77,58.27 C3.2 | 25.65,51.92 30.79,51.92 31.57,51.14 U1.1 32.84,45.23 | C6.2 R19.2 | 32.84,45.23 U1.38 | IR2.2 78.74,72.06 74.26,69.54 72.59,69.54 71.53,68.48 JM2.2 71.53,68.73 69.93,70.33 60.89,70.33 60.15,71.07 57.2,71.07 56.84,70.71 55.88,70.71 | C1.2 C2.2 61.84,45.65 60.24,45.65 54.39,51.49 | C11.2 65.72,34.58 65.3,34.16 v64.85,34.16 | v55.88,69.34 55.88,70.71
  pour Top: 60.44,66.01 77.22,66.01 78.74,64.49 78.74,51.41 76.23,48.89 58.01,48.89 56.17,50.74 56.17,61.75
  pour Top: 76.4,34.11 78.74,31.77 78.74,23.09 76.14,20.49 58.73,20.49 55.88,23.34 55.88,30.96 59.03,34.11
IO0  (via drill 0.5)
  Top 0.305: v69.8,45.83 69.1,45.83 62.45,39.18 v61.07,39.18
  Bottom 0.305: Q2.3 69.85,45.78 v69.8,45.83 | v61.07,39.18 61.07,38.61 58.6,36.13 57.05,36.13 52.45,31.53 50.82,31.53 49.35,33.01 U1.25
IO5  (via drill 0.5)
  Top 0.305: v23.47,49.59 23.47,52.89 22.54,53.82 22.54,56.17 27.81,61.44 GPIO5.1 | v44.2,27.96 42.49,26.26 35.53,26.26 v32.82,28.98
  Bottom 0.305: v23.47,49.59 24.08,48.98 24.08,34.24 25.2,33.12 28.85,33.12 32.82,29.16 v32.82,28.98 | U1.29 44.23,33.6 44.23,27.96 v44.2,27.96
IO12  (via drill 0.5)
  Top 0.305: U2.15 61.21,32.49 60.52,33.18 58.55,33.18 57.02,34.71 57.02,44.25 50.6,50.67 v50.6,54.52
  Bottom 0.305: U1.14 49.35,53.27 v50.6,54.52 51,54.92 51,60.86 51.58,61.44 R8.2
IO13  (via drill 0.5)
  Top 0.305: v63.5,38.58 v68.26,33.82 | v53.1,52.08 53.1,50.89 57.47,46.52 v57.56,46.52
  Bottom 0.305: R9.2 53.1,58.19 v53.1,52.08 | U2.10 73.91,29.92 73.05,29.06 70.77,29.06 70.1,29.73 70.1,31.98 v68.26,33.82 | U1.16 57.24,46.84 v57.56,46.52 59.21,44.87 61.29,44.87 62.74,43.42 62.74,39.69 63.5,38.93 v63.5,38.58
IO14  (via drill 0.5)
  Top 0.305: U2.2 61.21,21.72 59.03,19.53 56.51,19.53 56.2,19.21 v47.62,19.21 | v21.04,18.57 11.11,28.49 v11.11,32.31 | v12.7,47.79 12.2,48.29 12.2,56.98 24.28,69.06 36.51,69.06 41.59,63.98 43.11,63.98 47.47,59.63 v49.12,59.63
  Bottom 0.305: R7.2 52.39,62.9 52.21,62.72 51.35,62.72 49.12,60.49 v49.12,59.63 49.04,59.55 49.52,59.07 49.52,58.11 50.32,57.32 50.32,55.99 48.13,53.8 48.13,51.18 U1.13 | v47.62,19.21 37.41,19.21 34.99,16.79 22.8,16.79 21.04,18.55 v21.04,18.57 | v11.11,32.31 11.09,32.34 11.43,32.68 11.43,34.78 7.35,38.86 7.35,43.93 11.2,47.79 v12.7,47.79
IO15  (via drill 0.5)
  Top 0.305: v54.93,37.95 54.93,34.03 51.35,30.45 35.14,30.45 31.37,34.23 31.37,61.06 GPIO15.1
  Bottom 0.305: v54.93,37.95 U1.23
IO26  (via drill 0.5)
  Top 0.305: GPIO26.1 34.29,58.84 38.48,54.65 v44.6,54.65
  Bottom 0.305: v44.6,54.65 45.35,53.9 45.35,51.33 U1.11
IO27  (via drill 0.5)
  Top 0.305: v46.41,57.11 46.75,56.77 v49.18,56.77 49.26,56.84 52.04,56.84 53.11,55.78 53.11,54.51 58.06,49.56 58.06,48.1 58.71,47.45 58.71,39.89 60.53,38.07 60.53,36.9 64.85,32.59 64.85,29.59 65.63,28.8 68.83,28.8 73.76,23.87 73.76,23.42 U2.7
  Bottom 0.305: v49.18,56.77 49.18,56.36 46.8,53.98 U1.12 | R6.2 44.77,57.77 45.35,57.19 46.33,57.19 v46.41,57.11
IO32  (via drill 0.5)
  Top 0.305: v41.78,55.76 45.12,55.76 45.77,55.12 45.77,54.22 45.05,53.5 34.61,53.5 31.9,56.21 31.9,59.62 33.02,60.74 33.02,62.08 32.42,62.68 26.84,62.68 v24.92,60.77 | v8.24,46.32 8.43,46.14 8.43,38.01 12.3,34.14 12.3,29.04 16.1,25.25 19.38,25.25 21.76,22.87 21.76,21.45 XR1.E
  Bottom 0.305: XR1.E 21.76,21.45 21.76,23.37 19.68,25.45 19.68,27.15 R11.1 | v41.78,55.76 41.74,55.72 U1.8 | v24.92,60.77 24.65,60.77 19.91,56.03 14.44,56.03 11.43,53.02 11.43,49.51 v8.24,46.32
IO33  (via drill 0.5)
  Top 0.305: v43.18,57.31 43.18,57.95 44.45,59.22 44.45,61.76 42.86,63.35 37.78,63.35 35.91,65.22 27.09,65.22 22.89,61.02 22.89,57.68 16.83,51.62 16.83,49.44 14.76,47.37 14.76,38.42 v14.6,38.26
  Bottom 0.305: 19.05,29.69 15.3,29.69 XR2.E | v43.18,57.31 42.93,57.06 42.93,51.22 U1.9 | 19.05,29.69 15.39,33.35 15.39,37.51 14.63,38.26 v14.6,38.26 | 19.05,29.69 R13.1
IO34  (via drill 0.5)
  Top 0.305: v39.43,55.79 38.42,55.79 35.49,58.72 v35.49,59.44 | v30.43,56.23 29.59,55.4 29.59,53.57 24.1,48.07 17.41,48.07 15.87,46.54 v15.87,41.76
  Bottom 0.305: R15.1 16.83,37.63 15.87,38.58 v15.87,41.76 15.76,41.64 12.81,41.64 XR3.E | v39.43,55.79 39.23,55.59 39.23,51.18 U1.6 | v35.49,59.44 35.49,58.32 33.46,56.29 30.48,56.29 v30.43,56.23
IO36  (via drill 0.5)
  Top 0.305: v35.37,54.84 35.37,55.09 v33.02,57.44 | v30.43,57.69 25.78,57.69 v23.81,55.73
  Bottom 0.305: 16.83,51.6 R17.1 | 16.83,51.6 15.24,53.19 XR4.E | v35.37,54.84 35.37,53.95 36.56,52.75 36.56,51.23 U1.4 | v33.02,57.44 32.51,57.95 30.69,57.95 v30.43,57.69 | v23.81,55.73 20.95,55.73 16.83,51.6
IO39  (via drill 0.5)
  Top 0.305: v36.89,54.65 36.89,55.16 33.02,59.03 v33.02,59.1
  Bottom 0.305: XR5.E 20.89,61.71 25.88,61.71 27.56,60.03 27.56,58.9 R19.1 27.82,59.1 v33.02,59.1 | v36.89,54.65 37.89,53.65 37.89,51.18 U1.5
IR1
  Bottom 0.305: U1.30 43.04,33.6 43.04,27.09 44.2,25.93 64.41,25.93 65.33,25.02 71.93,25.02 72.85,24.1 72.85,21.36 75.36,18.85 75.42,18.72 75.38,16.7 IR1.3
IR2  (via drill 0.5)
  Top 0.305: v52.09,32.83 53.77,34.5 53.77,39.9 v54.99,41.12 | v60.92,42.56 60.97,42.61 60.97,49.11 55.61,54.47 55.61,60.57 v56.87,61.82 | v59.13,64.64 64.46,69.98 71.27,69.98 v71.96,70.66
  Bottom 0.305: U1.31 41.71,33.66 41.71,34.88 42.39,35.56 50.18,35.56 52.09,33.64 v52.09,32.83 | v54.99,41.12 59.44,41.12 v60.92,42.56 | v56.87,61.82 56.87,62.38 v59.13,64.64 | IR2.3 72.07,70.81 v71.96,70.66
IRTX
  Bottom 0.305: RB.2 23.81,32.23 25.53,30.52 28.46,30.52 31.22,27.76 33.86,27.76 34.85,28.75 34.85,30.1 34.05,30.9 34.05,33.58 U1.37
LEDS
  Bottom 0.305: CHARGING.4-DIN 52.33,67.06 52.33,66.14 50.91,64.72 50.91,63.5 47.92,60.52 47.92,56.84 46.94,55.85 44.14,55.85 43.48,55.19 43.48,54.09 44.23,53.34 44.23,51.18 U1.10
M1A
  Bottom 0.508: U2.3 63.75,21.72 66.26,19.21 | 66.26,19.21 66.25,19.21 65.53,18.49 JM1.1 | 66.26,19.21 68.57,19.21 C9.1
M1B
  Bottom 0.305: 71.12,19.21 C9.2 71.12,19.21 | 71.12,19.4 71.12,19.21 | 73.05,18.44 73.05,18.29
  Bottom 0.508: U2.6 71.37,19.66 71.12,19.4 | C9.2 71.96,19.53 73.05,18.44 | 73.05,18.29 73.05,16.71 JM1.6
M2A
  Top 0.508: U2.14 63.75,32.31 59.42,36.64 59.42,37.83 58.01,39.23 58.01,44.32 51.87,50.47 51.87,54.97 51.1,55.74 49.87,55.74 49.69,55.55 46.22,55.55 45.03,56.74 45.03,57.71 45.82,58.5 48.53,58.5 48.87,58.16 50.13,58.16 50.67,58.7 50.67,60.1 49.9,60.87 48,60.87 42.95,65.91 42.95,70.43 43.94,71.42 71,71.42 71.53,71.95 72.49,71.95 73.17,71.27 73.17,68.23 JM2.1
  Bottom 0.305: C10.1 68.35,36.04 63.75,31.45 U2.14
M2B
  Top 0.508: U2.11 71.37,33.1 72.59,34.32 72.59,35.69 78.46,41.55 78.46,45.59 78.44,45.61 78.44,56.44 79.04,57.04 79.04,65.15 77.2,66.99 65.99,66.99 65.53,67.46 JM2.6
  Bottom 0.305: C10.2 71.75,36.04 71.75,31.28 71.44,30.96 U2.11
N$1
  Top 0.635: CHG+.P$1 76.2,42.92 BT.+
  Bottom 0.635: BT.+ 78.74,42.39 F1.1
N$2
  Bottom 0.305: RB.1 19.91,32.23 19.91,37.72 18.1,39.53 Q4.1
N$3
  Bottom 0.635: F1.2 81.28,56.87 82.12,58.4 SW1.C
N$4
  Bottom 0.635: U4.3 71.75,60.58 | 71.75,60.58 63.51,60.58 D1.ANODE | L1.2 71.95,60.38 71.75,60.58
N$6
  Bottom 0.305: R12.2 13.55,27.25 13.55,33.01 XR2.A
N$7
  Bottom 0.305: XR4.A 16.45,57.26 13.28,57.26 R16.2
N$8  (via drill 0.5)
  Top 0.305: XR5.CATH 21.73,63.39 21.81,63.11 21.81,57.95 17.14,53.28 | v15.11,50.07 15.11,51.25 17.14,53.28 | XR4.CATH 15.9,54.68 17.14,53.44 17.14,53.28
  Bottom 0.305: 15.11,43.14 17.39,43.14 18.01,42.52 18.01,42.41 Q4.2 | 15.11,43.14 12.29,43.14 XR3.CATH 10.48,43.14 9.13,41.79 9.13,38.99 14.44,33.68 14.44,31.2 XR2.CATH 14.2,30.74 14.2,28.54 17.06,25.68 18.09,25.68 20.42,23.36 XR1.CATH | v15.11,50.07 15.11,43.14
N$9  (via drill 0.5)
  Top 0.305: v51.75,15.72 48.08,15.72 46.35,17.45 46.35,19.53 47.31,20.48 50.16,20.48 50.8,19.85 55.88,19.85 57.47,21.44 57.47,22.07 53.85,25.69 53.85,31.06 56.18,33.4 56.18,43.29 v55.85,43.62 | v59.84,43.71 59.82,43.74 59.82,47.01 58.56,48.27 58.56,49.85 53.73,54.67 53.73,60.39 52.54,61.58 49.08,61.58 44.04,66.63 v44.04,69.87
  Bottom 0.305: v51.75,15.72 51.75,14.13 STATE.4-DIN | v55.85,43.62 55.88,43.65 59.78,43.65 v59.84,43.71 | v44.04,69.87 44.85,70.69 47.04,70.69 CHARGING.2-DOUT
N$10
  Bottom 0.305: R14.2 12.28,29.79 12.28,34.93 8.23,38.98 8.23,43.28 10.59,45.64 XR3.A
N$11
  Bottom 0.305: R18.2 18.73,65.25 23.28,65.25 23.89,64.63 XR5.A
N$12
  Bottom 0.305: R4.2 77.15,39.83 76.56,40.42 75.2,40.42 74.61,41.01 Q1.1
N$13
  Bottom 0.305: R10.2 18.73,22.9 XR1.A
N$15
  Bottom 0.305: Q2.1 70.48,41.76 70.48,38.58 R5.2
RTS  (via drill 0.5)
  Top 0.305: v81.2,28.75 80.7,28.24 80.7,23.09 79.76,22.16 80.11,20.86 81.41,20.1 83.06,20.56 PROGRAMMER.3
  Bottom 0.305: Q1.2 72.71,41.76 72.51,41.56 72.51,38.52 72.44,38.58 R5.1 73.34,38.58 73.71,38.21 73.71,35.48 76.19,32.99 78.89,32.99 80.11,31.77 80.11,29.84 v81.2,28.75
RXD  (via drill 0.5)
  Top 0.305: PROGRAMMER.10 85.11,28.21 84.02,28.83 82.85,30 81.06,30 80.03,28.97 80.03,23.68 76.2,19.85 68.96,19.85 68.39,20.42 v67,20.42
  Bottom 0.305: U1.35 36.73,33.56 36.73,27.48 34.81,25.56 25.02,25.56 24.19,24.74 24.19,23.15 25.03,22.31 34.73,22.31 36.66,24.24 43.4,24.24 44.4,25.25 64.16,25.25 65,24.41 65,22.12 66.7,20.42 v67,20.42
SCL
  Bottom 0.305: U1.36 35.36,33.62 35.36,31.06 35.86,30.56 35.86,28.19 34.51,26.83 26.64,26.83 I2C.3
SDA
  Bottom 0.305: U1.33 38.98,33.42 38.98,27.99 35.28,24.29 26.64,24.29 I2C.4
TOUCH1  (via drill 0.5, 2)
  Top 0.305: v58.2,37.32 58.2,35.22 v59.07,34.35 | v23.02,25.25 22.66,25.25 9.41,38.5 9.41,47.28 11.41,49.28 11.41,58.44 23.43,70.46 T1.P$2 23.37,76.68 23.37,78.21 23.11,78.46 v23.23,78.66 | v48.67,23.19 50.9,25.42 v50.9,27.08
  Bottom 0.305: v23.02,25.25 23.02,23.19 25.24,20.97 35,20.97 36.85,22.82 44.25,22.82 45.87,24.43 47.42,24.43 v48.67,23.19 | U1.24 55.37,36.68 56.39,37.69 57.84,37.69 v58.2,37.32 | v50.9,27.08 51.89,27.08 59.07,34.25 v59.07,34.35
TOUCH2  (via drill 0.5, 2)
  Top 0.305: v26.83,17.96 23.4,14.53 23.4,8.16 23.54,8.02 23.62,8.1 T2.P$2 23.43,6.34 23.23,6.14 23.2,6.12 v23.23,6.12 | v48.16,28.22 48.16,25.93 46.79,24.56 v46.79,23.19
  Bottom 0.305: U1.26 48.17,33.55 v48.17,28.23 v48.16,28.22 | v46.79,23.19 44.65,21.06 37.03,21.06 33.94,17.96 v26.83,17.96
TXD  (via drill 0.5)
  Top 0.305: v37.85,28.5 38.84,29.49 50.72,29.49 52.45,27.76 52.45,23.7 v54.52,21.63 | v68.15,27.28 66.34,25.48 63.25,25.48 62.56,24.79 v62.56,20.5
  Bottom 0.305: v62.56,20.5 55.65,20.5 v54.52,21.63 | U1.34 37.92,28.5 v37.85,28.5 | v68.15,27.28 81.54,27.28 83.85,25.99 PROGRAMMER.8
VCC  (via drill 0.5)
  Top 0.305: v48.4,64.61 48.4,62.99 49.29,62.1 53.35,62.1 55.12,60.32 55.12,54.13 59.78,49.48 v59.78,48.72 | v79.76,48.83 79.53,48.83 79.53,35.19 85.03,29.69 85.97,29.18 86.13,29.09 86.49,27.95 82.93,21.79 PROGRAMMER.4
  Bottom 0.305: C1.1 66.67,41.12 67.18,41.63 67.18,44.68 66.04,45.82 66.04,47.6 65.1,48.54 U3.1 | 68.26,53.82 L1.1 67.94,53.19 67.31,53.19 | v48.4,64.61 47.3,64.61 R2.2 | v59.78,48.72 59.78,49.76 61.89,51.87 66.99,51.87 U3.3
  Bottom 0.635: SW1.A 79.76,62.56 v79.76,48.83 79.28,49.31 67.01,49.31 U3.3 66.99,50.33 | C3.1 68.26,53.82 68.26,53.5 67.94,53.19 | U3.1 65.09,50.33 65.4,50.65 66.67,50.65 66.99,50.33 | 66.99,50.33 66.99,52.87 67.31,53.19
(copper drawn outside any net)
  shapes: Top circle x2

### Text on the board
tPlace: M1 GND C1 C2 VCC M2 | 3V3 GND D0 | ON | +5V GND | - | RESET | + | OFF | SDA SCL GND +3V3 | GND | GND | DTR | RTS | SWARMESH 2020 / 2020/07/22 / v1.0.4 | M1 GND C1 C2 VCC M2 | +3V3 GND D0
bPlace: POWER | - | +
tNames: IR2